# Altium schematic sheet Selection_1.SchDoc: Title
size 431 x 279 mm; Date: *******; ApprovedBy: *******; CheckedBy: Dahami Fernando; Author: *******; CompanyName: *******; DrawnBy: Rivikula Fernando; Engineer: *******; Organization: *******; Address1: *******; Address2: *******; Address3: *******; Address4: *******; DocumentNumber: Doc Num; Revision: *******; SheetNumber: 4; SheetTotal: 9; Subtitle: Selectiom; Project: Distotion_Gitar_Pedal; VersionRevision: 1; TotalSheet: 8; CurrentTime: *******; CurrentDate: *******; Time: *******; DocumentFullPathAndName: *******; DocumentName: *******; ModifiedDate: *******; ImagePath: *******; ProjectName: *******; Application_BuildNumber: *******
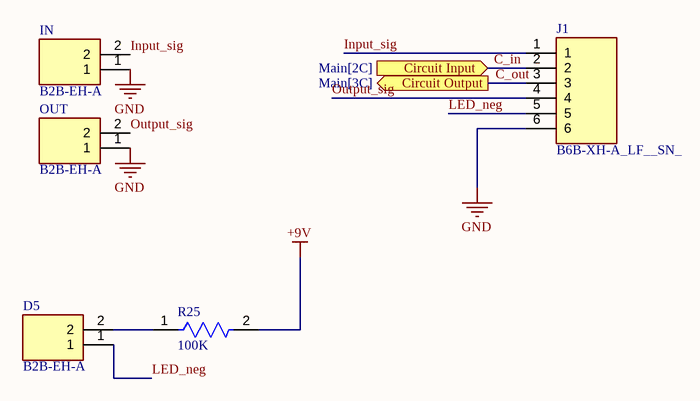
[diagram p0: Selection_1.SchDoc]

## Parts
D5  B2B-EH-A  [SHDR2W64P0X250_1X2_750X380X600P]
IN  B2B-EH-A  [SHDR2W64P0X250_1X2_750X380X600P]
J1  B6B-XH-A_LF__SN_  [SHDR6W64P0X250_1X6_1740X575X700P]
OUT  B2B-EH-A  [SHDR2W64P0X250_1X2_750X380X600P]
R25  100K  [FP-MRS1600-MFG]

## Ports
Circuit Input (in, see Main[2C]), Circuit Output (out, see Main[3C])

## Nets
+9V: R25.2
GND: IN.1 J1.6 OUT.1
C_in: J1.2 ; port Circuit Input
C_out: J1.3 ; port Circuit Output
Input_sig: IN.2 J1.1
LED_neg: D5.1 J1.5
Output_sig: J1.4 OUT.2
NetD5_2: D5.2 R25.1

## Notes on the sheet
- DWG. NO.
- REV.
- SHT.
- THIS DOCUMENT AND THE DATA DISCLOSED HEREIN OR HEREWITH IS THE PROPERTY OF ALTIUM LIMITED AND MAY BE FREELY DISTRIBUTED IN WHOLE. NO RIGHTS ARE RESERVED OR EXPRESS OR IMPLIED WARANTEE GIVEN.
- REVISION
- DESCRIPTION
- DATE
- APPROVED
- ENG:
- APPROVALS
- PROJECT
- DSN:
- CHK:
- REFERENCE DOCUMENTS
- PROJECT REVISION:
- TITLE
- DOCUMENT REVISION:
- DESIGN ITEM:
- BOM:
- FAB DWG:
- PCB DWG:
- ASSY DWG:
- SCALE:
- SIZE
- B
- CAGE CODE
- FILE NAME
- DWG NO.
- SHEET
- OF
- REV

## Library data of the parts
D5 IN OUT = B2B-EH-A: Connector; Manufacturer_Name: JST (JAPAN SOLDERLESS TERMINALS); Datasheet Link: http://www.jst-mfg.com/product/pdf/eng/eEH.pdf; Height: 6mm; Manufacturer_Part_Number: B2B-EH-A
J1 = B6B-XH-A_LF__SN_: Connector; Manufacturer_Name: JST (JAPAN SOLDERLESS TERMINALS); Manufacturer_Part_Number: B6B-XH-A(LF)(SN); Datasheet Link: https://datasheet.lcsc.com/szlcsc/JST-Sales-America-B6B-XH-A-LF-SN_C144397.pdf; Height: 7mm; Mouser Part Number: 306-B6BXHALFSN; Mouser Price/Stock: https://www.mouser.co.uk/ProductDetail/JST-Commercial/B6B-XH-ALFSN?qs=cdbOS8ANM9AKmMmofXbwlw%3D%3D; Arrow Part Number: B6B-XH-A(LF)(SN); Arrow Price/Stock: https://www.arrow.com/en/products/b6b-xh-a-lf-sn/jst-manufacturing?region=europe
R25 = CMP-02408-000019-1: RES 20K OHM 0.4W 1% AXIAL; Max Power Dissipation: 400mW; Temperature Coefficient: 50ppm/°C; Resistance: 20kR; Technology: THIN FILM; Max Operating Temperature: 155°C; Number of Terminations: 2; RoHS Compliant: Yes; Packaging: Tape and Reel; Radiation Hardening: No; Contact Plating: Tin; Military Standard: Not; Construction: Cylindrical; Diameter: 1.6mm; Tolerance: 1%; Mount: Through Hole; Power Rating: 400mW; Case/Package: Conformal; Termination: Axial; Length: 3.6mm; Min Operating Temperature: -55°C; Resistor Type: Metal Film; Series: MRS16